# EAGLE schematic ftdi_programmer_to_atmega_328p (EAGLE 9.1.3)
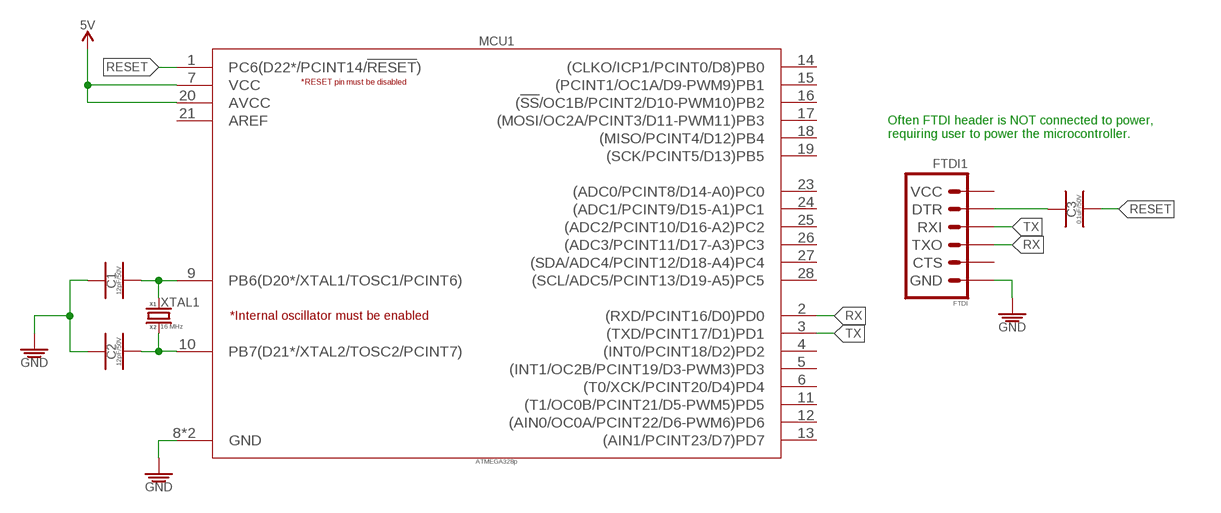
[diagram p0: schematic, sheet 1]

## Parts
C1  12pF/50V  12PF_PTH-CER_50V-5%  [_CER_PTH_LS2.5_L4-W2.5-H5.58]
C2  12pF/50V  12PF_PTH-CER_50V-5%  [_CER_PTH_LS2.5_L4-W2.5-H5.58]
C3  0.1uF/50V  0.1UF_PTH-CER_50V-10%  [_CER_PTH_LS2.5_L4-W2.5-H5.58]
FTDI1  FTDI  FTDI_PTH_VERT_MALE_2.54MM  [HDRV6W64P254_1X6_1524X254X838B_FTDI]
MCU1  ATMEGA328p  ATMEGA328P-28_28-PDIP_8BIT_32KB  [DIP762W53P254L3467H472Q28B]
XTAL1  16 MHz  CRYSTAL_ABL_16MHZ_18PF  [HC-49/US]

## Nets
5V: MCU1.7(VCC) MCU1.20(AVCC)
GND: C1.P$1 C2.P$1 FTDI1.GND MCU1.8(GND) MCU1.22(GND)
N$1: C3.P$1 FTDI1.DTR
N$2: C2.P$2 MCU1.10(PB7(D21*/XTAL2/TOSC2/PCINT7)) XTAL1.P$2(XTAL2)
N$3: C1.P$2 MCU1.9(PB6(D20*/XTAL1/TOSC1/PCINT6)) XTAL1.P$1(XTAL1)
RESET: C3.P$2 MCU1.1(PC6(D22*/PCINT14/!RESET!))
RX: FTDI1.TX(TXO) MCU1.2((RXD/PCINT16/D0)PD0)
TX: FTDI1.RX(RXI) MCU1.3((TXD/PCINT17/D1)PD1)
Unconnected: FTDI1.CTS FTDI1.VCC MCU1.4((INT0/PCINT18/D2)PD2) MCU1.5((INT1/OC2B/PCINT19/D3-PWM3)PD3) MCU1.6((T0/XCK/PCINT20/D4)PD4) MCU1.11((T1/OC0B/PCINT21/D5-PWM5)PD5) MCU1.12((AIN0/OC0A/PCINT22/D6-PWM6)PD6) MCU1.13((AIN1/PCINT23/D7)PD7) MCU1.14((CLKO/ICP1/PCINT0/D8)PB0) MCU1.15((PCINT1/OC1A/D9-PWM9)PB1) MCU1.16((!SS!/OC1B/PCINT2/D10-PWM10)PB2) MCU1.17((MOSI/OC2A/PCINT3/D11-PWM11)PB3) MCU1.18((MISO/PCINT4/D12)PB4) MCU1.19((SCK/PCINT5/D13)PB5) MCU1.21(AREF) MCU1.23((ADC0/PCINT8/D14-A0)PC0) MCU1.24((ADC1/PCINT9/D15-A1)PC1) MCU1.25((ADC2/PCINT10/D16-A2)PC2) MCU1.26((ADC3/PCINT11/D17-A3)PC3) MCU1.27((SDA/ADC4/PCINT12/D18-A4)PC4) MCU1.28((SCL/ADC5/PCINT13/D19-A5)PC5)

## Notes on the sheet
- Often FTDI header is NOT connected to power, 
  requiring user to power the microcontroller.

## Library data of the parts
C1 C2 = PiB_capacitors:12PF; DATASHEET: http://www.vishay.com/docs/45171/kseries.pdf; DIST: Digikey; DISTLINK: https://www.digikey.com/products/en?keywords=BC1002CT-ND; DISTPN: BC1002CT-ND; MFR: Vishay BC Components; MPN: K120J15C0GF5TL2
C3 = PiB_capacitors:0.1UF; DATASHEET: http://www.vishay.com/docs/45171/kseries.pdf; DIST: Digikey; DISTLINK: https://www.digikey.com/products/en?keywords=BC1084CT-ND; DISTPN: BC1084CT-ND; MFR: Vishay BC Components; MPN: K104K15X7RF5TL2
FTDI1 = PiB_connectors:FTDI: FTDI Basic header with labels; DATASHEET: https://media.digikey.com/pdf/Data%20Sheets/Sparkfun%20PDFs/DEV-09873_Web.pdf; DATASHEET_CONNECTOR: https://drawings-pdf.s3.amazonaws.com/C10436.pdf; DIST: Digikey; DISTLINK: https://www.digikey.com/products/en?keywords=1568-1104-ND; DISTLINK_CONNECTOR: https://www.digikey.com/products/en?keywords=PEC06SAAN; DISTPN: 1568-1104-ND; DISTPN_CONNECTOR: S1012E-06-ND; DIST_CONNECTOR: Digikey; MFR: SparkFun Electronics; MFR_CONNECTOR: Sullins Connector Solutions; MPN: DEV-09873; MPN_CONNECTOR: PEC06SAAN
MCU1 = PiB_ic_microcontrollers:ATMEGA328P-28: ATMEGA328P 28PIN IC; DATASHEET: http://ww1.microchip.com/downloads/en/DeviceDoc/Atmel-42735-8-bit-AVR-Microcontroller-ATmega328-328P_Datasheet.pdf; DIST: Digikey; DISTLINK: https://www.digikey.com/products/en?keywords=ATMEGA328P-PU-ND; DISTPN: ATMEGA328P-PU-ND; MFR: Microchip Technology; MPN: ATMEGA328P-PU
XTAL1 = PiB_crystals_oscillators_resonators:CRYSTAL: Various standard crystals. Proven footprints.; DATASHEET: https://abracon.com/Resonators/ABL.pdf; DIST: Digikey; DISTLINK: https://www.digikey.com/products/en?keywords=535-9041-ND; DISTPN: 535-9041-ND; MFR: Abracon LLC; MPN: ABL-16.000MHZ-B2